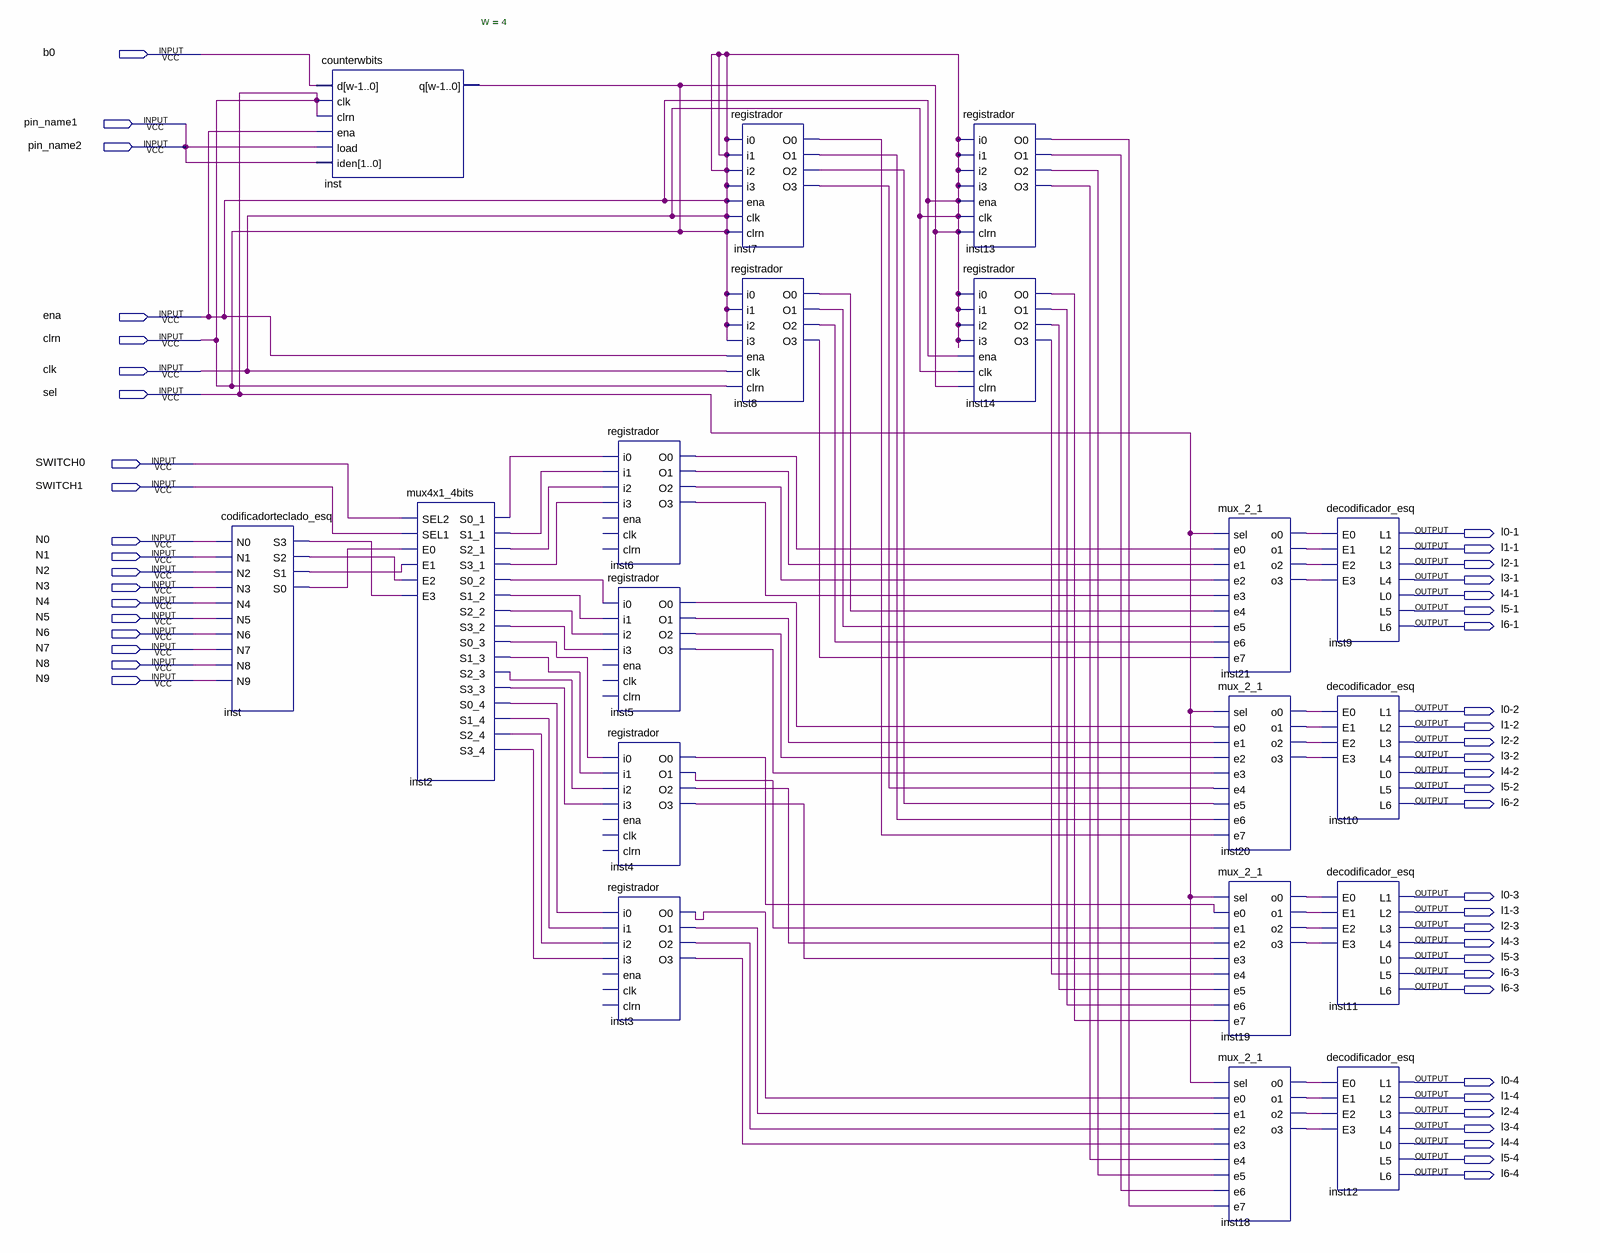
[diagram p0: schematic sheet]
// Quartus schematic completo.bdf as structural Verilog: 19 symbols, 47 pins
module completo (
  input  b0,
  input  pin_name1,
  input  pin_name2,
  input  ena,
  input  clrn,
  input  clk,
  input  sel,
  input  SWITCH0,
  input  SWITCH1,
  input  N0,
  input  N1,
  input  N2,
  input  N3,
  input  N4,
  input  N5,
  input  N6,
  input  N7,
  input  N8,
  input  N9,
  output \l0-1 ,
  output \l1-1 ,
  output \l2-1 ,
  output \l3-1 ,
  output \l4-1 ,
  output \l5-1 ,
  output \l6-1 ,
  output \l0-2 ,
  output \l1-2 ,
  output \l2-2 ,
  output \l3-2 ,
  output \l4-2 ,
  output \l5-2 ,
  output \l6-2 ,
  output \l0-3 ,
  output \l1-3 ,
  output \l2-3 ,
  output \l4-3 ,
  output \l5-3 ,
  output \l6-3 ,
  output \l0-4 ,
  output \l1-4 ,
  output \l2-4 ,
  output \l3-4 ,
  output \l4-4 ,
  output \l5-4 ,
  output \l6-4 
);

  wire inst2_s0_1, inst2_s0_2, inst2_s0_3, inst2_s0_4, inst2_s1_1, inst2_s1_2, inst2_s1_3, inst2_s1_4,
       inst2_s2_1, inst2_s2_2, inst2_s2_3, inst2_s2_4, inst2_s3_1, inst2_s3_2, inst2_s3_3, inst2_s3_4,
       inst3_o0, inst3_o1, inst3_o2, inst3_o3, inst4_o0, inst4_o1, inst4_o2, inst4_o3, inst5_o0, inst5_o1,
       inst5_o2, inst5_o3, inst6_o0, inst6_o1, inst6_o2, inst6_o3, inst7_o0, inst7_o1, inst7_o2, inst7_o3,
       inst8_o0, inst8_o1, inst8_o2, inst8_o3, inst13_o0, inst13_o1, inst13_o2, inst13_o3, inst14_o0,
       inst14_o1, inst14_o2, inst14_o3, inst18_o0, inst18_o1, inst18_o2, inst18_o3, inst19_o0, inst19_o1,
       inst19_o2, inst19_o3, inst20_o0, inst20_o1, inst20_o2, inst20_o3, inst21_o0, inst21_o1, inst21_o2,
       inst21_o3, inst_s0, inst_s1, inst_s2, inst_s3;

  codificadorteclado_esq inst (
    .N0(N0), .N1(N1), .N2(N2), .N3(N3), .N4(N4), .N5(N5), .N6(N6), .N7(N7), .N8(N8), .N9(N9), .S3(inst_s3),
    .S2(inst_s2), .S1(inst_s1), .S0(inst_s0));
  counterwbits #(.W(4)) inst_dup2 (
    .d({4{b0}}), .clk(clk), .clrn(clk), .ena(clk), .load(pin_name1), .iden({2{pin_name1}}), .q(clk));
  mux4x1_4bits inst2 (
    .SEL2(SWITCH0), .SEL1(SWITCH1), .E0(inst_s0), .E1(inst_s1), .E2(inst_s2), .E3(inst_s3),
    .S0_1(inst2_s0_1), .S1_1(inst2_s1_1), .S2_1(inst2_s2_1), .S3_1(inst2_s3_1), .S0_2(inst2_s0_2),
    .S1_2(inst2_s1_2), .S2_2(inst2_s2_2), .S3_2(inst2_s3_2), .S0_3(inst2_s0_3), .S1_3(inst2_s1_3),
    .S2_3(inst2_s2_3), .S3_3(inst2_s3_3), .S0_4(inst2_s0_4), .S1_4(inst2_s1_4), .S2_4(inst2_s2_4),
    .S3_4(inst2_s3_4));
  registrador inst6 (
    .i0(inst2_s0_1), .i1(inst2_s1_1), .i2(inst2_s2_1), .i3(inst2_s3_1), .O0(inst6_o0), .O1(inst6_o1),
    .O2(inst6_o2), .O3(inst6_o3));  // open: ena, clk, clrn
  registrador inst5 (
    .i0(inst2_s0_2), .i1(inst2_s1_2), .i2(inst2_s2_2), .i3(inst2_s3_2), .O0(inst5_o0), .O1(inst5_o1),
    .O2(inst5_o2), .O3(inst5_o3));  // open: ena, clk, clrn
  registrador inst4 (
    .i0(inst2_s0_3), .i1(inst2_s1_3), .i2(inst2_s2_3), .i3(inst2_s3_3), .O0(inst4_o0), .O1(inst4_o1),
    .O2(inst4_o2), .O3(inst4_o3));  // open: ena, clk, clrn
  registrador inst3 (
    .i0(inst2_s0_4), .i1(inst2_s1_4), .i2(inst2_s2_4), .i3(inst2_s3_4), .O0(inst3_o0), .O1(inst3_o1),
    .O2(inst3_o2), .O3(inst3_o3));  // open: ena, clk, clrn
  registrador inst7 (
    .i0(clk), .i1(clk), .i2(clk), .i3(clk), .ena(clk), .clk(clk), .clrn(clk), .O0(inst7_o0), .O1(inst7_o1),
    .O2(inst7_o2), .O3(inst7_o3));
  registrador inst8 (
    .i0(clk), .i1(clk), .i2(clk), .i3(clk), .ena(clk), .clk(clk), .clrn(clk), .O0(inst8_o0), .O1(inst8_o1),
    .O2(inst8_o2), .O3(inst8_o3));
  registrador inst13 (
    .i0(clk), .i1(clk), .i2(clk), .i3(clk), .ena(clk), .clk(clk), .clrn(clk), .O0(inst13_o0), .O1(inst13_o1),
    .O2(inst13_o2), .O3(inst13_o3));
  registrador inst14 (
    .i0(clk), .i1(clk), .i2(clk), .i3(clk), .ena(clk), .clk(clk), .clrn(clk), .O0(inst14_o0), .O1(inst14_o1),
    .O2(inst14_o2), .O3(inst14_o3));
  mux_2_1 inst21 (
    .sel(clk), .e0(inst6_o0), .e1(inst6_o1), .e2(inst6_o2), .e3(inst6_o3), .e4(inst8_o0), .e5(inst8_o1),
    .e6(inst8_o2), .e7(inst8_o3), .o0(inst21_o0), .o1(inst21_o1), .o2(inst21_o2), .o3(inst21_o3));
  mux_2_1 inst20 (
    .sel(clk), .e0(inst5_o0), .e1(inst5_o1), .e2(inst5_o2), .e3(inst5_o3), .e4(inst7_o3), .e5(inst7_o2),
    .e6(inst7_o1), .e7(inst7_o0), .o0(inst20_o0), .o1(inst20_o1), .o2(inst20_o2), .o3(inst20_o3));
  mux_2_1 inst19 (
    .sel(clk), .e0(inst4_o0), .e1(inst4_o1), .e2(inst4_o2), .e3(inst4_o3), .e4(inst14_o3), .e5(inst14_o2),
    .e6(inst14_o1), .e7(inst14_o0), .o0(inst19_o0), .o1(inst19_o1), .o2(inst19_o2), .o3(inst19_o3));
  mux_2_1 inst18 (
    .sel(clk), .e0(inst3_o0), .e1(inst3_o1), .e2(inst3_o2), .e3(inst3_o3), .e4(inst13_o3), .e5(inst13_o2),
    .e6(inst13_o1), .e7(inst13_o0), .o0(inst18_o0), .o1(inst18_o1), .o2(inst18_o2), .o3(inst18_o3));
  decodificador_esq inst9 (
    .E0(inst21_o0), .E1(inst21_o1), .E2(inst21_o2), .E3(inst21_o3), .L1(\l0-1 ), .L2(\l1-1 ), .L3(\l2-1 ),
    .L4(\l3-1 ), .L0(\l4-1 ), .L5(\l5-1 ), .L6(\l6-1 ));
  decodificador_esq inst10 (
    .E0(inst20_o0), .E1(inst20_o1), .E2(inst20_o2), .E3(inst20_o3), .L1(\l0-2 ), .L2(\l1-2 ), .L3(\l2-2 ),
    .L4(\l3-2 ), .L0(\l4-2 ), .L5(\l5-2 ), .L6(\l6-2 ));
  decodificador_esq inst11 (
    .E0(inst19_o0), .E1(inst19_o1), .E2(inst19_o2), .E3(inst19_o3), .L1(\l0-3 ), .L2(\l1-3 ), .L3(\l2-3 ),
    .L4(\l4-3 ), .L0(\l5-3 ), .L5(\l6-3 ), .L6(\l6-3 ));
  decodificador_esq inst12 (
    .E0(inst18_o0), .E1(inst18_o1), .E2(inst18_o2), .E3(inst18_o3), .L1(\l0-4 ), .L2(\l1-4 ), .L3(\l2-4 ),
    .L4(\l3-4 ), .L0(\l4-4 ), .L5(\l5-4 ), .L6(\l6-4 ));

  assign clrn = clk;
  assign ena = clk;
  assign pin_name2 = pin_name1;
  assign sel = clk;
endmodule
